# Altium schematic sheet Scheme.SchDoc: Наименование
size 839 x 594 mm; Name1: мониторинга климатических; Name2: параметров СХД; ApprovedBy: Утвердил; CheckedBy: Проверил; Author: Разработал; CompanyName: Организация; DrawnBy: Н.Контр; Engineer: Т.Контр; SheetNumber: 1; SheetTotal: 1; PageSetup: Record=PageOptions|CenterHorizontal=True|CenterVertical=True|PrintScale=0.94|XCorrection=1.00|YCorrection=1.00|PrintKind=1|BorderSize=5000000|LeftOffset=0|BottomOffset=0|Orientation=1|PaperLength=1000|PaperWidth=1000|Scale=100|PaperSource=7|PrintQuality=-4|MediaType=1|DitherType=10|PaperKind=A4|PrintScaleMode=1; DecimalNumber: Децимальный номер; HeadOfSector: Нач. сектора; MainDevice: Перв.примен.; Name: Наименование; DocumentName: Sheet1.SCHDOC
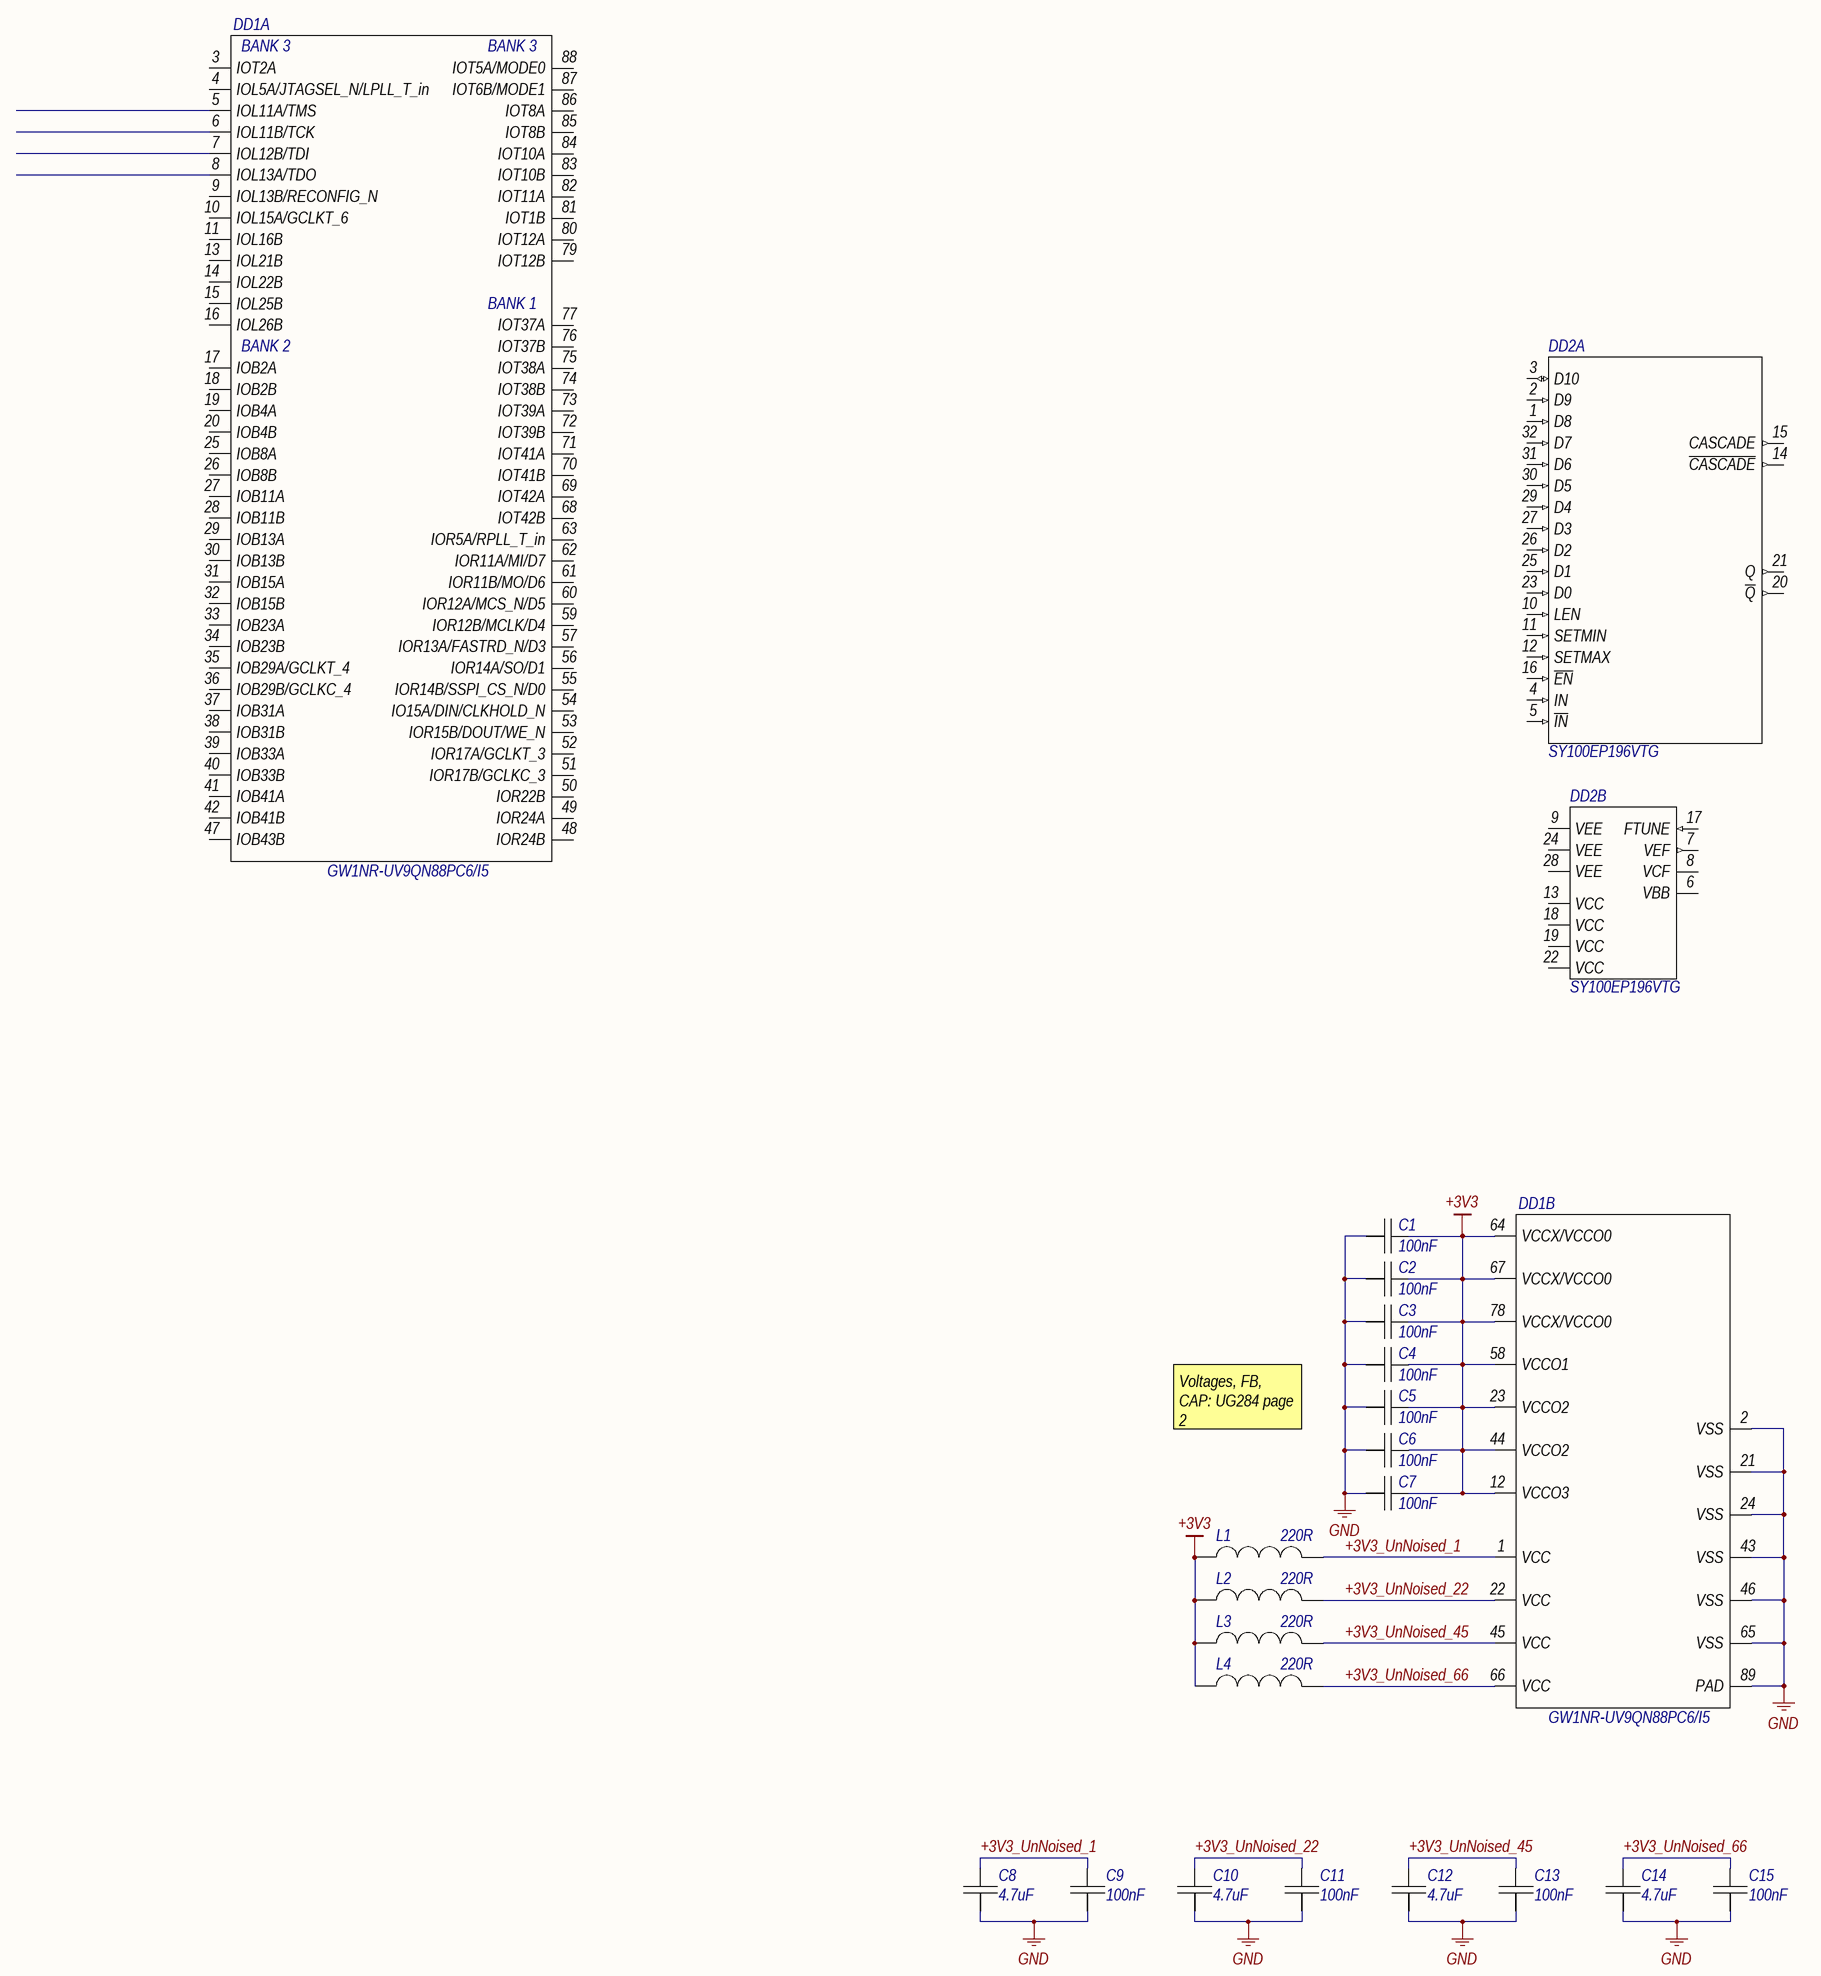
[diagram p0: Scheme.SchDoc]

## Parts
C1  value 100nF  [CAP0402]  (hidden comment: 100nF 16V)
C2  value 100nF  [CAP0402]  (hidden comment: 100nF 16V)
C3  value 100nF  [CAP0402]  (hidden comment: 100nF 16V)
C4  value 100nF  [CAP0402]  (hidden comment: 100nF 16V)
C5  value 100nF  [CAP0402]  (hidden comment: 100nF 16V)
C6  value 100nF  [CAP0402]  (hidden comment: 100nF 16V)
C7  value 100nF  [CAP0402]  (hidden comment: 100nF 16V)
C8  value 4.7uF  [CAP0402]  (hidden comment: 4.7uF 10V)
C9  value 100nF  [CAP0402]  (hidden comment: 100nF 16V)
C10  value 4.7uF  [CAP0402]  (hidden comment: 4.7uF 10V)
C11  value 100nF  [CAP0402]  (hidden comment: 100nF 16V)
C12  value 4.7uF  [CAP0402]  (hidden comment: 4.7uF 10V)
C13  value 100nF  [CAP0402]  (hidden comment: 100nF 16V)
C14  value 4.7uF  [CAP0402]  (hidden comment: 4.7uF 10V)
C15  value 100nF  [CAP0402]  (hidden comment: 100nF 16V)
DD1  GW1NR-UV9QN88PC6/I5  [QFN88_0.4pitch]  (parts A,B of 2)
DD2  (no value)  [TQFP-32_M]  (parts A,B of 2)
L1  220R  [CAPC0603N]
L2  220R  [CAPC0603N]
L3  220R  [CAPC0603N]
L4  220R  [CAPC0603N]

## Nets
+3V3: C1.2 C2.2 C3.2 C4.2 C5.2 C6.2 C7.2 DD1.12(VCCO3) DD1.23(VCCO2) DD1.44(VCCO2) DD1.58(VCCO1) DD1.64(VCCX/VCCO0) DD1.67(VCCX/VCCO0) DD1.78(VCCX/VCCO0) L1.1 L2.1 L3.1 L4.1
GND: C1.1 C2.1 C3.1 C4.1 C5.1 C6.1 C7.1 C8.1 C9.1 C10.1 C11.1 C12.1 C13.1 C14.1 C15.1 DD1.2(VSS) DD1.21(VSS) DD1.24(VSS) DD1.43(VSS) DD1.46(VSS) DD1.65(VSS) DD1.89(PAD)
+3V3_UnNoised_1: C8.2 C9.2 DD1.1(VCC) L1.2
+3V3_UnNoised_22: C10.2 C11.2 DD1.22(VCC) L2.2
+3V3_UnNoised_45: C12.2 C13.2 DD1.45(VCC) L3.2
+3V3_UnNoised_66: C14.2 C15.2 DD1.66(VCC) L4.2

Not connected (* = marked no-connect by the designer): DD1 3(IOT2A) 4(IOL5A/JTAGSEL_N/LPLL_T_in) 5(IOL11A/TMS) 6(IOL11B/TCK) 7(IOL12B/TDI) 8(IOL13A/TDO) 9(IOL13B/RECONFIG_N) 10(IOL15A/GCLKT_6) 11(IOL16B) 13(IOL21B) 14(IOL22B) 15(IOL25B) 16(IOL26B) 17(IOB2A) 18(IOB2B) 19(IOB4A) 20(IOB4B) 25(IOB8A) 26(IOB8B) 27(IOB11A) 28(IOB11B) 29(IOB13A) 30(IOB13B) 31(IOB15A) 32(IOB15B) 33(IOB23A) 34(IOB23B) 35(IOB29A/GCLKT_4) 36(IOB29B/GCLKC_4) 37(IOB31A) 38(IOB31B) 39(IOB33A) 40(IOB33B) 41(IOB41A) 42(IOB41B) 47(IOB43B) 48(IOR24B) 49(IOR24A) 50(IOR22B) 51(IOR17B/GCLKC_3) 52(IOR17A/GCLKT_3) 53(IOR15B/DOUT/WE_N) 54(IO15A/DIN/CLKHOLD_N) 55(IOR14B/SSPI_CS_N/D0) 56(IOR14A/SO/D1) 57(IOR13A/FASTRD_N/D3) 59(IOR12B/MCLK/D4) 60(IOR12A/MCS_N/D5) 61(IOR11B/MO/D6) 62(IOR11A/MI/D7) 63(IOR5A/RPLL_T_in) 68(IOT42B) 69(IOT42A) 70(IOT41B) 71(IOT41A) 72(IOT39B) 73(IOT39A) 74(IOT38B) 75(IOT38A) 76(IOT37B) 77(IOT37A) 79(IOT12B) 80(IOT12A) 81(IOT1B) 82(IOT11A) 83(IOT10B) 84(IOT10A) 85(IOT8B) 86(IOT8A) 87(IOT6B/MODE1) 88(IOT5A/MODE0); DD2 1(D8) 2(D9) 3(D10) 4(IN) 5(~{IN}) 6(VBB) 7(VEF) 8(VCF) 9(VEE) 10(LEN) 11(SETMIN) 12(SETMAX) 13(VCC) 14(~{CASCADE}) 15(CASCADE) 16(~{EN}) 17(FTUNE) 18(VCC) 19(VCC) 20(~{Q}) 21(Q) 22(VCC) 23(D0) 24(VEE) 25(D1) 26(D2) 27(D3) 28(VEE) 29(D4) 30(D5) 31(D6) 32(D7)

## Notes on the sheet
- Voltages, FB, CAP: UG284 page 2
- Перв.примен.
- Справ.№
- Подп. и дата
- Инв.№ дубл.
- Взам.инв.№
- Подп.и дата
- Разраб.
- Изм.
- Лист
- № докум.
- Подп.
- Дата
- Лит.
- Масштаб
- Масса
- Т.контр.
- Пров.
- СХЕМА   ЭЛЕКТРИЧЕСКАЯ
- ПРИНЦИПИАЛЬНАЯ
- Листов
- Инв.№ подл.
- Утв.
- Н.контр.
- Нач.сект.
- Формат  A1
- (in symbol GW1NR-UV9QN88PC6/I5, part A) BANK 3; BANK 1; BANK 2

## Library data of the parts
C1-C7 C9 C11 C13 C15 = CAP0402: Manufacturer: Samsung Electro-Mechanics; ManufacturerAlt: JLCPCB; MPN: CL05B104KO5NNNC; MPNAlt: C1525; MntType: SMD; Tolerance: 10%; Height: 0.5mm; MSL: MSL 1; Package: =Footprint; RoHS: Comply; Weight: 1.500mg; PartType: CHIP CERAMIC CAPACITOR; Pins: 2; BOMDescription: =MntType+' '+PartType+' '+Package+' '+Value+' '+Tolerance+' '+Voltage+' '+TempCoeff+' '+MPN; CFootprint: =Footprint; Voltage: 16V; Part Number: CAP0402; ClassName: Capacitor; ComponentLink1Description: Datasheet; ComponentLink1Description: New link; ComponentLink1URL: https://datasheet.lcsc.com/lcsc/1810191219_Samsung-Electro-Mechanics-CL05B104KO5NNNC_C1525.pdf
C8 C10 C12 C14 = CAP0402: Manufacturer: Samsung Electro-Mechanics; ManufacturerAlt: JLCPCB; MPN: CL05A475MP5NRNC; MPNAlt: C23733; MntType: SMD; Tolerance: 20%; Height: 0.5mm; MSL: MSL 1; Package: =Footprint; RoHS: Comply; Weight: 1.500mg; PartType: CHIP CERAMIC CAPACITOR; Pins: 2; BOMDescription: =MntType+' '+PartType+' '+Package+' '+Value+' '+Tolerance+' '+Voltage+' '+TempCoeff+' '+MPN; CFootprint: =Footprint; Voltage: 10V; Part Number: CAP0402; ClassName: Capacitor; ComponentLink1Description: Datasheet; ComponentLink1Description: New link; ComponentLink1URL: https://datasheet.lcsc.com/lcsc/1810191211_Samsung-Electro-Mechanics-CL05A475MP5NRNC_C23733.pdf
DD1 = GW1NR-UV9QN88PC6/I5: Manufacturer: GoWin; MntType: SMD; ComponentLink1Description: Datasheet; MPN: GW1NR-UV9QN88PC6/I5; Part Number: GW1NR-UV9QN88PC6/I5; Height: 0.9 mm; MSL: MSL 1; Package: QFN-88; RoHS: Comply; PartType: FPGA; Pins: 88; BOMDescription: GW1NR-UV9QN88PC6/I5; CFootprint: =Footprint; ClassName: FPGA; ComponentLink1URL: https://www.gowinsemi.com/en/support/database/?support_search=DS117
DD2 = SY100EP196VTG: Manufacturer: Microchip; MntType: SMD; MPN: SY100EP196VTG; Part Number: SY100EP196VTG; MSL: MSL 1; Package: TQFP-32; RoHS: Comply; PartType: Delay; Pins: 32; BOMDescription: =MntType+' '+PartType+' '+Package+' '+Value+' '+Tolerance+' '+Voltage+' '+TempCoeff+' '+MPN; CFootprint: =Footprint; ComponentLink1Description: Datasheet; ComponentLink1URL: https://ww1.microchip.com/downloads/en/DeviceDoc/SY100EP196V-3.3V-5V-2.5GHz-Programmable-Delay-Chip-with-Fine-Tune-Control-DS20006520A.pdf
L1-L4 = BLM18KG221SN1D: Manufacturer: Murata Electronics; ManufacturerAlt: JLCPCB; MPNAlt: C88980; MntType: SMD; Tolerance: 25%; MPN: BLM18KG221SN1D; Height: 0.6mm; MSL: MSL 1; Package: =Footprint; RoHS: Comply; Weight: 5mg; PartType: Ferrite Beads; Pins: 2; BOMDescription: =MntType+' '+PartType+' '+Package+' '+Value+' '+Tolerance+' '+Voltage+' '+TempCoeff+' '+MPN; CFootprint: =Footprint; Value: 220R; Part Number: BLM18KG221SN1D; ClassName: Ferrite Beads; ComponentLink1Description: Datasheet; ComponentLink1URL: https://ru.mouser.com/datasheet/2/281/ENFA0003-1915778.pdf